# Altium schematic sheet Copy of main.SchDoc
size A3
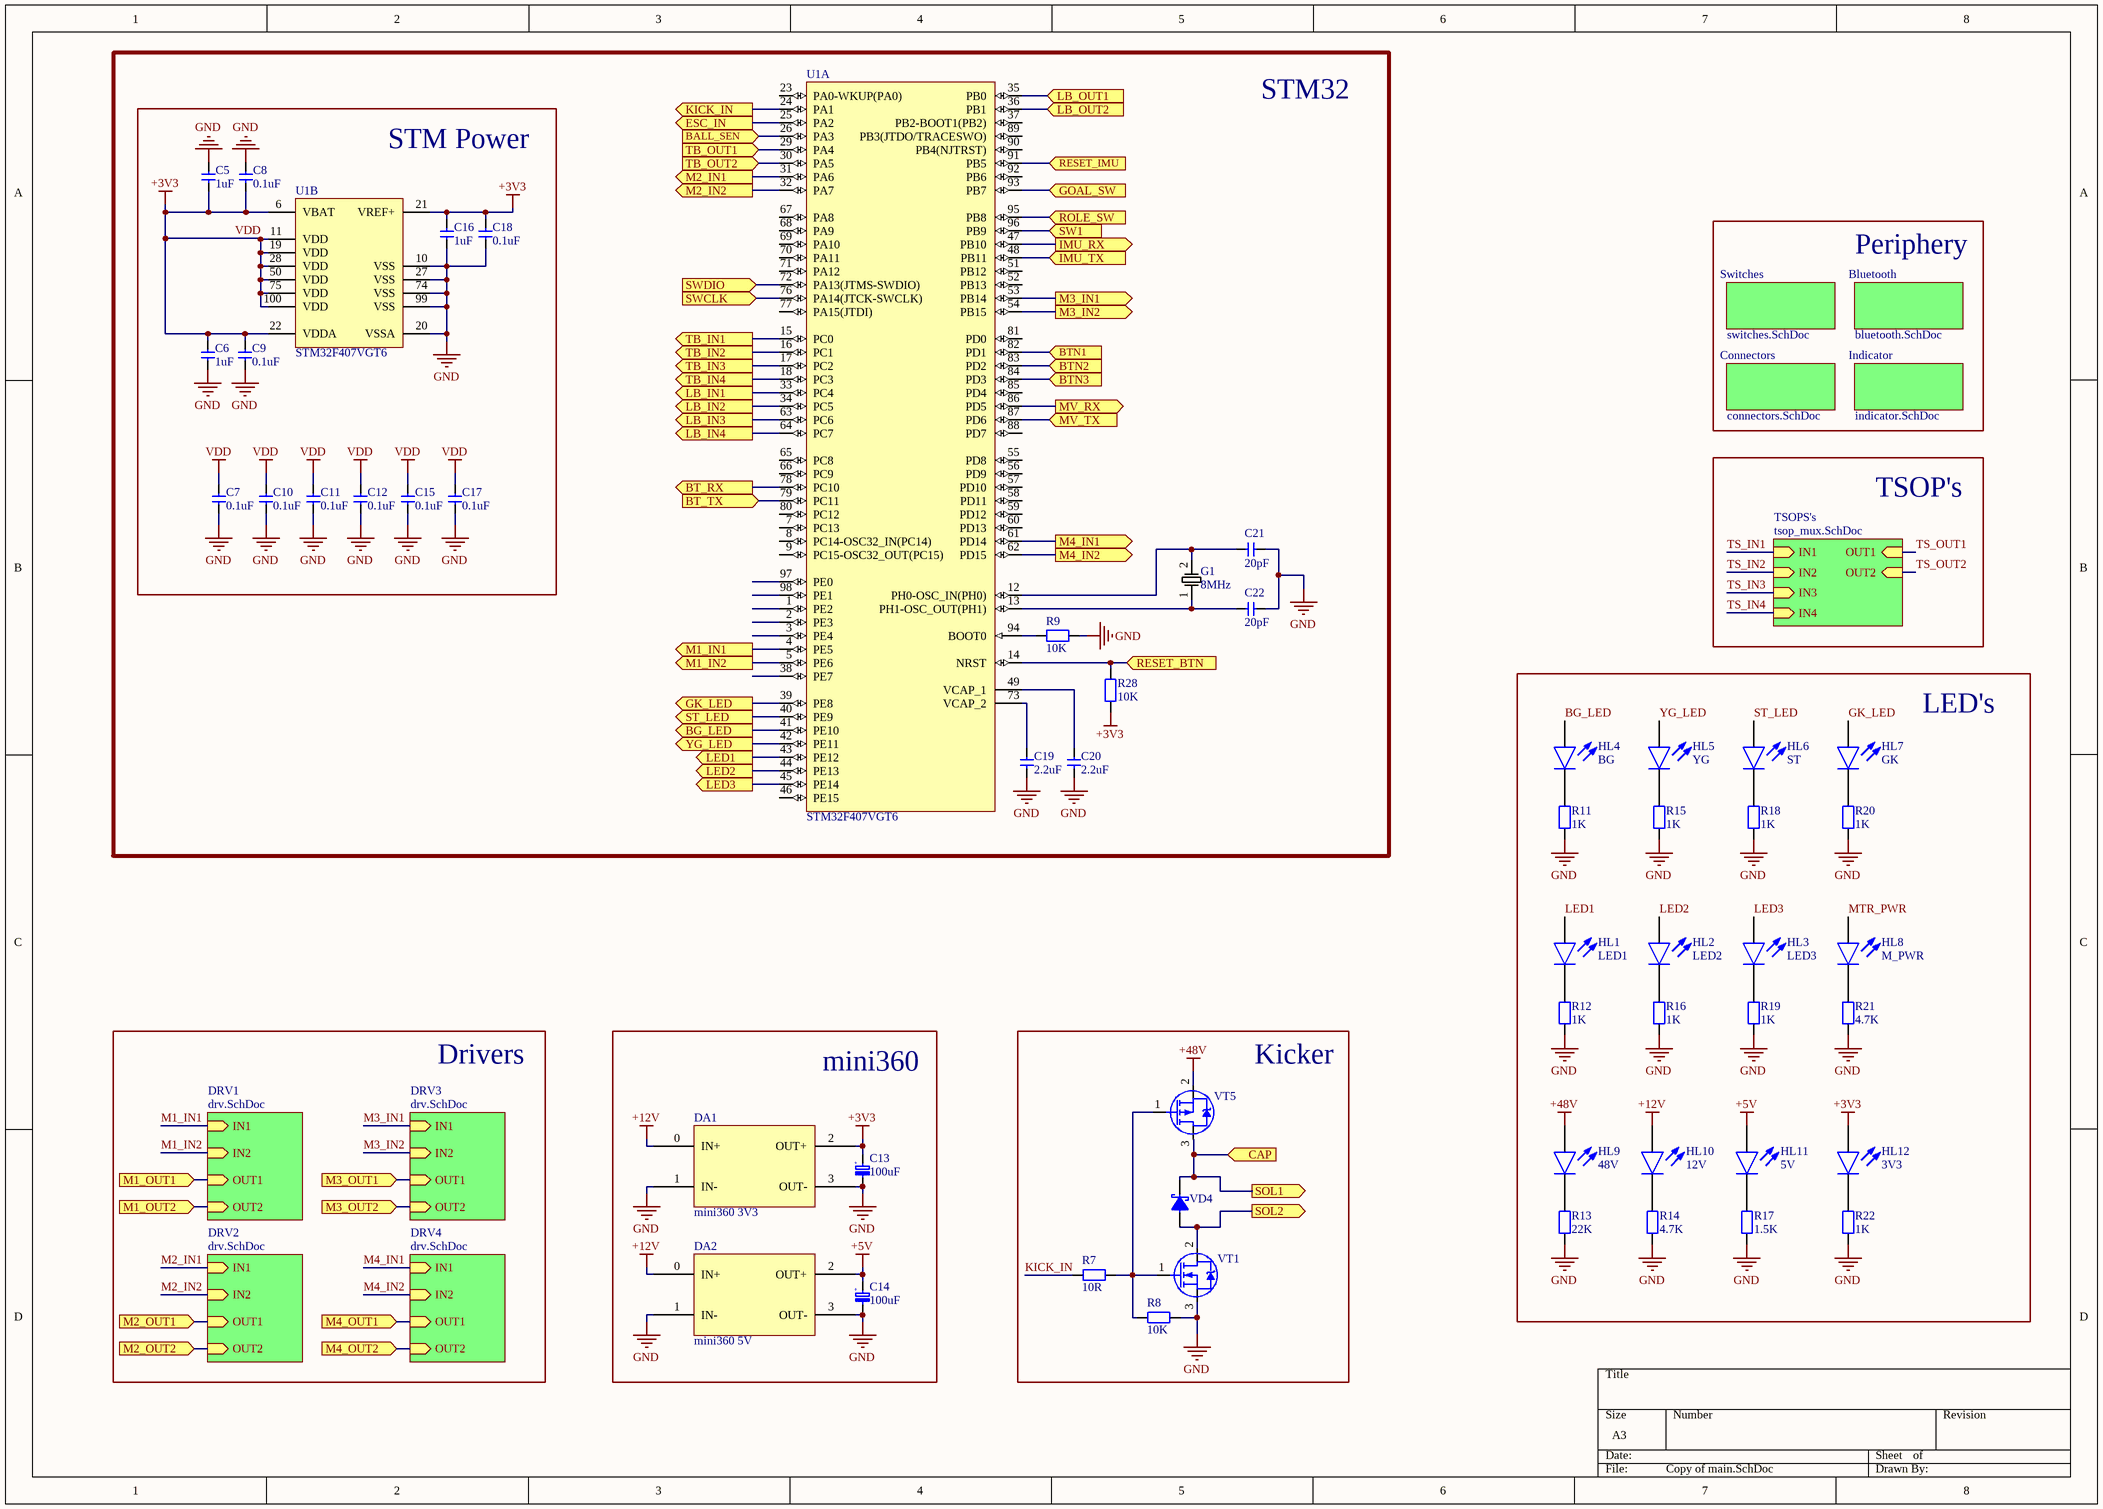
[diagram p0: Copy of main.SchDoc]

## Parts
C5  1uF  [CAP0603]
C6  1uF  [CAP0603]
C7  0.1uF  [CAP0603]
C8  0.1uF  [CAP0603]
C9  0.1uF  [CAP0603]
C10  0.1uF  [CAP0603]
C11  0.1uF  [CAP0603]
C12  0.1uF  [CAP0603]
C13  100uF  [CAP_TANT_D]
C14  100uF  [CAP_TANT_D]
C15  0.1uF  [CAP0603]
C16  1uF  [CAP0603]
C17  0.1uF  [CAP0603]
C18  0.1uF  [CAP0603]
C19  2.2uF  [CAP0603]
C20  2.2uF  [CAP0603]
C21  20pF  [CAP0603]
C22  20pF  [CAP0603]
DA1  mini360 3V3  [mini360]
DA2  mini360 5V  [mini360]
G1  8MHz  [CRYSTAL_HC49-US-SM]
HL1  LED1  [LED0603_GREEN]
HL2  LED2  [LED0603_GREEN]
HL3  LED3  [LED0603_GREEN]
HL4  BG  [LED0603_GREEN]
HL5  YG  [LED0603_GREEN]
HL6  ST  [LED0603_GREEN]
HL7  GK  [LED0603_GREEN]
HL8  M_PWR  [LED0603_RED]
HL9  48V  [LED0603_RED]
HL10  12V  [LED0603_RED]
HL11  5V  [LED0603_RED]
HL12  3V3  [LED0603_RED]
R7  10R  [RES0805]
R8  10K  [RES0805]
R9  10K  [RES0805]
R11  1K  [RES0805]
R12  1K  [RES0805]
R13  22K  [RES0805]
R14  4.7K  [RES0805]
R15  1K  [RES0805]
R16  1K  [RES0805]
R17  1.5K  [RES0805]
R18  1K  [RES0805]
R19  1K  [RES0805]
R20  1K  [RES0805]
R21  4.7K  [RES0805]
R22  1K  [RES0805]
R28  10K  [RES0805]
U1  STM32F407VGT6  [LQFP100]  (parts A,B of 2)
VD4  Diode Schottky  [DO-214AC]  (value not drawn)
VT1  N-Channel Mosfet  [TO252AA]  (value not drawn)
VT5  IRFR9024N  [TO252AA]  (value not drawn)

## Blocks framed on the sheet
STM32: C19-C22 G1 R9 R28 U1
STM Power: C5-C12 C15-C18 U1
LED's: HL1-HL12 R11-R22
mini360: C13 C14 DA1 DA2
Kicker: R7 R8 VD4 VT1 VT5

## Sub-sheets
Bluetooth = bluetooth.SchDoc: no entries
Connectors = connectors.SchDoc: no entries
DRV1 = drv.SchDoc: IN1 (in), OUT2 (in), IN2 (in), OUT1 (in)
DRV2 = drv.SchDoc: IN1 (in), OUT2 (in), IN2 (in), OUT1 (in)
DRV3 = drv.SchDoc: IN1 (in), OUT2 (in), IN2 (in), OUT1 (in)
DRV4 = drv.SchDoc: IN1 (in), OUT2 (in), IN2 (in), OUT1 (in)
Indicator = indicator.SchDoc: no entries
Switches = switches.SchDoc: no entries
TSOPS's = tsop_mux.SchDoc: OUT2 (in), OUT1 (in), IN3 (in), IN1 (in), IN4 (in), IN2 (in)

## Ports
BALL_SEN (in), BG_LED (out), BT_RX (out), BT_TX (in), BTN1 (in), BTN2 (in), BTN3 (in), CAP (in), ESC_IN (out), GK_LED (out), GOAL_SW (in), IMU_RX (out), IMU_TX (in), KICK_IN (out), LB_IN1 (out), LB_IN2 (out), LB_IN3 (out), LB_IN4 (out), LB_OUT1 (in), LB_OUT2 (in), LED1 (out), LED2 (out), LED3 (out), M1_IN1 (out), M1_IN2 (out), M1_OUT1 (in), M1_OUT2 (in), M2_IN1 (out), M2_IN2 (out), M2_OUT1 (in), M2_OUT2 (in), M3_IN1 (out), M3_IN2 (out), M3_OUT1 (in), M3_OUT2 (in), M4_IN1 (out), M4_IN2 (out), M4_OUT1 (in), M4_OUT2 (in), MV_RX (out), MV_TX (in), RESET_BTN (in), RESET_IMU (in), ROLE_SW (in), SOL1 (out), SOL2 (out), ST_LED (out), SW1 (in), SWCLK (in), SWDIO (in), TB_IN1 (out), TB_IN2 (out), TB_IN3 (out), TB_IN4 (out), TB_OUT1 (in), TB_OUT2 (in), YG_LED (out)

## Nets
+5V: C14.2(PLUS) DA2.2(OUT+) HL11.2(A)
+12V: DA1.0(IN+) DA2.0(IN+) HL10.2(A)
+48V: HL9.2(A) VT5.2(S)
GND: C5.2 C6.1 C7.1 C8.2 C9.1 C10.1 C11.1 C12.1 C13.1(MINUS) C14.1(MINUS) C15.1 C16.1 C17.1 C18.1 C19.1 C20.1 C21.1 C22.1 DA1.1(IN-) DA1.3(OUT-) DA2.1(IN-) DA2.3(OUT-) R8.1 R9.2 R11.1 R12.1 R13.1 R14.1 R15.1 R16.1 R17.1 R18.1 R19.1 R20.1 R21.1 R22.1 U1.10(VSS) U1.20(VSSA) U1.27(VSS) U1.74(VSS) U1.99(VSS) VT1.3(S)
VDD: C5.1 C6.2 C7.2 C8.1 C9.2 C10.2 C11.2 C12.2 C13.2(PLUS) C15.2 C16.2 C17.2 C18.2 DA1.2(OUT+) HL12.2(A) R28.1 U1.6(VBAT) U1.11(VDD) U1.19(VDD) U1.21(VREF+) U1.22(VDDA) U1.28(VDD) U1.50(VDD) U1.75(VDD) U1.100(VDD)  [also labelled +3V3]
BALL_SEN: U1.26(PA3) ; port BALL_SEN
BG_LED: HL4.2(A)
BG_LED: U1.41(PE10) ; port BG_LED  [a separate net that carries the same name]
BT_RX: U1.78(PC10) ; port BT_RX
BT_TX: U1.79(PC11) ; port BT_TX
BTN1: U1.82(PD1) ; port BTN1
BTN2: U1.83(PD2) ; port BTN2
BTN3: U1.84(PD3) ; port BTN3
CAP: VD4.1(K) VT5.3(D) ; port CAP, port SOL1
ESC_IN: U1.25(PA2) ; port ESC_IN
GK_LED: HL7.2(A)
GK_LED: U1.39(PE8) ; port GK_LED  [a separate net that carries the same name]
GOAL_SW: U1.93(PB7) ; port GOAL_SW
IMU_RX: U1.47(PB10) ; port IMU_RX
IMU_TX: U1.48(PB11) ; port IMU_TX
KICK_IN: R7.2
KICK_IN: U1.24(PA1) ; port KICK_IN  [a separate net that carries the same name]
LB_IN1: U1.33(PC4) ; port LB_IN1
LB_IN2: U1.34(PC5) ; port LB_IN2
LB_IN3: U1.63(PC6) ; port LB_IN3
LB_IN4: U1.64(PC7) ; port LB_IN4
LB_OUT1: U1.35(PB0) ; port LB_OUT1
LB_OUT2: U1.36(PB1) ; port LB_OUT2
LED1: HL1.2(A)
LED1: U1.43(PE12) ; port LED1  [a separate net that carries the same name]
LED2: HL2.2(A)
LED2: U1.44(PE13) ; port LED2  [a separate net that carries the same name]
LED3: HL3.2(A)
LED3: U1.45(PE14) ; port LED3  [a separate net that carries the same name]
M1_IN1: U1.4(PE5) ; port M1_IN1
M1_IN1: sheet DRV1/IN1  [a separate net that carries the same name]
M1_IN2: U1.5(PE6) ; port M1_IN2
M1_IN2: sheet DRV1/IN2  [a separate net that carries the same name]
M1_OUT1: port M1_OUT1, sheet DRV1/OUT1
M1_OUT2: port M1_OUT2, sheet DRV1/OUT2
M2_IN1: U1.31(PA6) ; port M2_IN1
M2_IN1: sheet DRV2/IN1  [a separate net that carries the same name]
M2_IN2: U1.32(PA7) ; port M2_IN2
M2_IN2: sheet DRV2/IN2  [a separate net that carries the same name]
M2_OUT1: port M2_OUT1, sheet DRV2/OUT1
M2_OUT2: port M2_OUT2, sheet DRV2/OUT2
M3_IN1: U1.53(PB14) ; port M3_IN1
M3_IN1: sheet DRV3/IN1  [a separate net that carries the same name]
M3_IN2: U1.54(PB15) ; port M3_IN2
M3_IN2: sheet DRV3/IN2  [a separate net that carries the same name]
M3_OUT1: port M3_OUT1, sheet DRV3/OUT1
M3_OUT2: port M3_OUT2, sheet DRV3/OUT2
M4_IN1: U1.61(PD14) ; port M4_IN1
M4_IN1: sheet DRV4/IN1  [a separate net that carries the same name]
M4_IN2: U1.62(PD15) ; port M4_IN2
M4_IN2: sheet DRV4/IN2  [a separate net that carries the same name]
M4_OUT1: port M4_OUT1, sheet DRV4/OUT1
M4_OUT2: port M4_OUT2, sheet DRV4/OUT2
MTR_PWR: HL8.2(A)
MV_RX: U1.86(PD5) ; port MV_RX
MV_TX: U1.87(PD6) ; port MV_TX
RESET_BTN: R28.2 U1.14(NRST) ; port RESET_BTN
RESET_IMU: U1.91(PB5) ; port RESET_IMU
ROLE_SW: U1.95(PB8) ; port ROLE_SW
SOL2: VD4.2(A) VT1.2(D) ; port SOL2
ST_LED: HL6.2(A)
ST_LED: U1.40(PE9) ; port ST_LED  [a separate net that carries the same name]
SW1: U1.96(PB9) ; port SW1
SWCLK: U1.76(PA14(JTCK-SWCLK)) ; port SWCLK
SWDIO: U1.72(PA13(JTMS-SWDIO)) ; port SWDIO
TB_IN1: U1.15(PC0) ; port TB_IN1
TB_IN2: U1.16(PC1) ; port TB_IN2
TB_IN3: U1.17(PC2) ; port TB_IN3
TB_IN4: U1.18(PC3) ; port TB_IN4
TB_OUT1: U1.29(PA4) ; port TB_OUT1
TB_OUT2: U1.30(PA5) ; port TB_OUT2
TS_IN1: sheet TSOPS's/IN1
TS_IN2: sheet TSOPS's/IN2
TS_IN3: sheet TSOPS's/IN3
TS_IN4: sheet TSOPS's/IN4
TS_OUT1: sheet TSOPS's/OUT1
TS_OUT2: sheet TSOPS's/OUT2
YG_LED: HL5.2(A)
YG_LED: U1.42(PE11) ; port YG_LED  [a separate net that carries the same name]
NetC19_2: C19.2 U1.73(VCAP_2)
NetC20_2: C20.2 U1.49(VCAP_1)
NetC21_2: C21.2 G1.2 U1.12(PH0-OSC_IN(PH0))
NetC22_2: C22.2 G1.1 U1.13(PH1-OSC_OUT(PH1))
NetHL1_1: HL1.1(K) R12.2
NetHL2_1: HL2.1(K) R16.2
NetHL3_1: HL3.1(K) R19.2
NetHL4_1: HL4.1(K) R11.2
NetHL5_1: HL5.1(K) R15.2
NetHL6_1: HL6.1(K) R18.2
NetHL7_1: HL7.1(K) R20.2
NetHL8_1: HL8.1(K) R21.2
NetHL9_1: HL9.1(K) R13.2
NetHL10_1: HL10.1(K) R14.2
NetHL11_1: HL11.1(K) R17.2
NetHL12_1: HL12.1(K) R22.2
NetR7_1: R7.1 R8.2 VT1.1(G) VT5.1(G)
NetR9_1: R9.1 U1.94(BOOT0)

Not connected (* = marked no-connect by the designer): U1 1(PE2) 2(PE3) 3(PE4) 7(PC13) 8(PC14-OSC32_IN(PC14)) 9(PC15-OSC32_OUT(PC15)) 23(PA0-WKUP(PA0)) 37(PB2-BOOT1(PB2)) 38(PE7) 46(PE15) 51(PB12) 52(PB13) 55(PD8) 56(PD9) 57(PD10) 58(PD11) 59(PD12) 60(PD13) 65(PC8) 66(PC9) 67(PA8) 68(PA9) 69(PA10) 70(PA11) 71(PA12) 77(PA15(JTDI)) 80(PC12) 81(PD0) 85(PD4) 88(PD7) 89(PB3(JTDO/TRACESWO)) 90(PB4(NJTRST)) 92(PB6) 97(PE0) 98(PE1)

## Notes on the sheet
- Periphery
- TSOP's
- Drivers
- (in symbol CAP Tantal) +

## Library data of the parts
C5-C12 C15-C22 = CAP Ceramic: Ceramic SMD Cap
C13 C14 = CAP Tantal: Tantal SMD Cap
DA1 DA2 = mini360
G1 = ECS-160-20-5PX-TR: CRYSTAL 16.0000MHZ 20PF SMD; Part Number: ECS-160-20-5PX-TR; HelpURL: https://www.digikey.com/product-detail/en/ecs-inc/ECS-160-20-5PX-TR/XC1282CT-ND/827746
HL1-HL7 = LED: LED smd Green
HL8-HL12 = LED: LED smd Red
R7-R9 R11-R22 R28 = RES: RES smd
U1 = STM32F407VGT6: ARM Cortex-M4 32-bit MCU+FPU, 210 DMIPS, 1024 kB Flash, 192 kB Internal RAM, 82 I/Os, 100-pin LQFP, -40 to 85 degC, Tray; Manufacturer: STMicroelectronics; D/A Converter: 2x12-bit; FLASH Size (Prog) (kB): 1024; I/Os (High Current): 82; Internal RAM Size (kB): 192; Operating Frequency(F) (Processor speed) (MHz): 168; Supply Voltage(Vcc) max (V): 3.6; Supply Voltage(Vcc) min (V): 1.8; DatasheetVersion: Rev. 4; PackageVersion: Rev. 1, 06/2013; PackageReference: LQFP100; PackageDescription: 100-Pin Low Profile Quad Flat Package, 14 x 14 mm Body, 0.5 mm Pitch; Supplier 1: Digi-Key; Supplier Part Number 1: 497-11605-ND; Supplier 2: Farnell; Supplier Part Number 2: 2064368; Supplier 3: Newark; Supplier Part Number 3: 73T2333; Supplier 4: Mouser; Supplier Part Number 4: 511-STM32F407VGT6; Core: ARM Cortex-M4; Packing: Tray; Mounting Technology: Surface Mount; PartNumber: STM32F407VGT6; ComponentLink1Description: Manufacturer URL; ComponentLink1URL: http://www.st.com/web/en/home.html; ComponentLink2Description: Datasheet; ComponentLink2URL: http://www.st.com/st-web-ui/static/active/en/resource/technical/document/datasheet/DM00037051.pdf; ComponentLink3Description: Package Specification; ComponentLink3URL: http://www.st.com/st-web-ui/static/active/en/resource/technical/document/data_brief/DM00071938.pdf
VT1 = IRFR2405: DPAK; Part Number: IRFR2405
VT5 = IRFR9024N: Part Number: IRFR9024N